# Altium schematic sheet Sheet2.SchDoc
size A
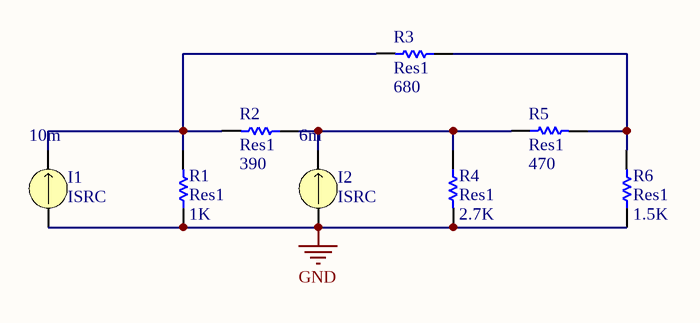
[diagram p0: Sheet2.SchDoc]

## Parts
I1  ISRC  value 10m
I2  ISRC  value 6m
R1  Res1  value 1K  [AXIAL-0.3]
R2  Res1  value 390  [AXIAL-0.3]
R3  Res1  value 680  [AXIAL-0.3]
R4  Res1  value 2.7K  [AXIAL-0.3]
R5  Res1  value 470  [AXIAL-0.3]
R6  Res1  value 1.5K  [AXIAL-0.3]

## Nets
GND: I1.1 I2.1 R1.1 R4.2 R6.1
NetI1_2: I1.2 R1.2 R2.2 R3.2
NetI2_2: I2.2 R2.1 R4.1 R5.1
NetR3_1: R3.1 R5.2 R6.2

## Library data of the parts
I1 I2 = ISRC: Current Source; Note: PCB Footprint - Not required; Published: 8-Jun-2000; LatestRevisionDate: 17-Jul-2002; LatestRevisionNote: Re-released for DXP Platform.; PackageReference: Not Applicable; Publisher: Altium Limited
R1-R6 = Res1: Resistor; Published: 8-Jun-2000; LatestRevisionDate: 17-Jul-2002; LatestRevisionNote: Re-released for DXP Platform.; PackageReference: AXIAL-0.3; Publisher: Altium Limited; PackageDescription: Axial Device, Thru-Hole; 2 Leads; 0.3 in Pin Spacing